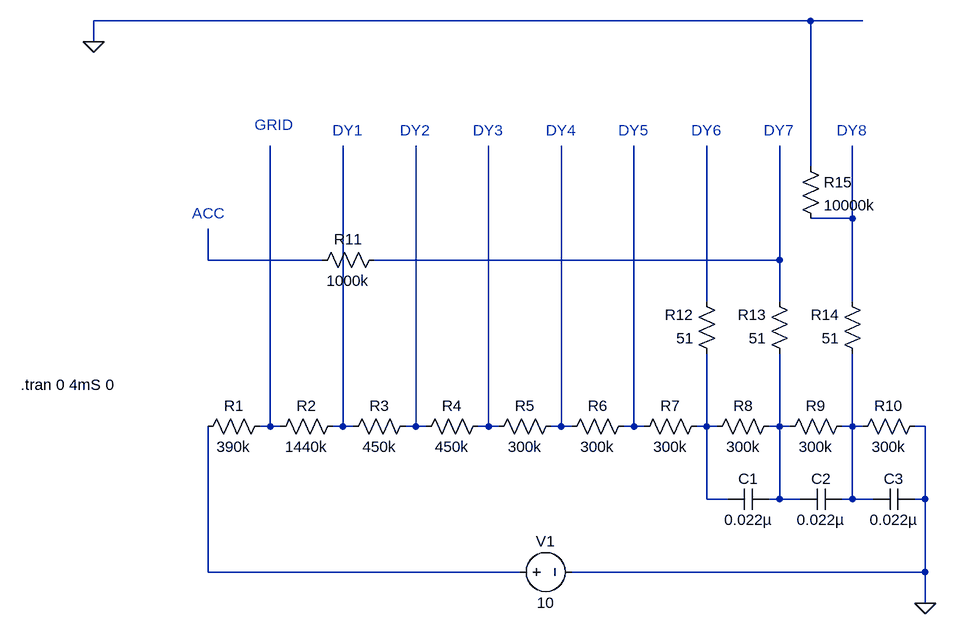
[diagram p0: schematic divider.asc]
divider.asc, the LTspice schematic file:
Version 4
SHEET 1 992 792
WIRE 800 -176 -304 -176
WIRE 880 -176 800 -176
WIRE -304 -144 -304 -176
WIRE 800 48 800 -176
WIRE 864 128 864 16
WIRE 864 128 800 128
WIRE -128 192 -128 144
WIRE 48 192 -128 192
WIRE 752 192 752 16
WIRE 752 192 128 192
WIRE 640 256 640 16
WIRE 752 256 752 192
WIRE 864 256 864 128
WIRE -32 448 -32 16
WIRE -32 448 -48 448
WIRE -16 448 -32 448
WIRE 80 448 80 16
WIRE 80 448 64 448
WIRE 96 448 80 448
WIRE 192 448 192 16
WIRE 192 448 176 448
WIRE 208 448 192 448
WIRE 304 448 304 16
WIRE 304 448 288 448
WIRE 320 448 304 448
WIRE 416 448 416 16
WIRE 416 448 400 448
WIRE 432 448 416 448
WIRE 528 448 528 16
WIRE 528 448 512 448
WIRE 544 448 528 448
WIRE 640 448 640 336
WIRE 640 448 624 448
WIRE 656 448 640 448
WIRE 752 448 752 336
WIRE 752 448 736 448
WIRE 768 448 752 448
WIRE 864 448 864 336
WIRE 864 448 848 448
WIRE 880 448 864 448
WIRE 976 448 960 448
WIRE 640 560 640 448
WIRE 672 560 640 560
WIRE 752 560 752 448
WIRE 752 560 736 560
WIRE 784 560 752 560
WIRE 864 560 864 448
WIRE 864 560 848 560
WIRE 896 560 864 560
WIRE 976 560 976 448
WIRE 976 560 960 560
WIRE -128 672 -128 448
WIRE 352 672 -128 672
WIRE 976 672 976 560
WIRE 976 672 432 672
WIRE 976 720 976 672
FLAG 976 720 0
FLAG -304 -144 0
SYMBOL res -32 432 R90
WINDOW 0 0 56 VBottom 2
WINDOW 3 32 56 VTop 2
SYMATTR InstName R1
SYMATTR Value 390k
SYMBOL res 80 432 R90
WINDOW 0 0 56 VBottom 2
WINDOW 3 32 56 VTop 2
SYMATTR InstName R2
SYMATTR Value 1440k
SYMBOL res 192 432 R90
WINDOW 0 0 56 VBottom 2
WINDOW 3 32 56 VTop 2
SYMATTR InstName R3
SYMATTR Value 450k
SYMBOL res 304 432 R90
WINDOW 0 0 56 VBottom 2
WINDOW 3 32 56 VTop 2
SYMATTR InstName R4
SYMATTR Value 450k
SYMBOL res 416 432 R90
WINDOW 0 0 56 VBottom 2
WINDOW 3 32 56 VTop 2
SYMATTR InstName R5
SYMATTR Value 300k
SYMBOL res 528 432 R90
WINDOW 0 0 56 VBottom 2
WINDOW 3 32 56 VTop 2
SYMATTR InstName R6
SYMATTR Value 300k
SYMBOL res 640 432 R90
WINDOW 0 0 56 VBottom 2
WINDOW 3 32 56 VTop 2
SYMATTR InstName R7
SYMATTR Value 300k
SYMBOL res 752 432 R90
WINDOW 0 0 56 VBottom 2
WINDOW 3 32 56 VTop 2
SYMATTR InstName R8
SYMATTR Value 300k
SYMBOL res 864 432 R90
WINDOW 0 0 56 VBottom 2
WINDOW 3 32 56 VTop 2
SYMATTR InstName R9
SYMATTR Value 300k
SYMBOL res 976 432 R90
WINDOW 0 0 56 VBottom 2
WINDOW 3 32 56 VTop 2
SYMATTR InstName R10
SYMATTR Value 300k
SYMBOL res 144 176 R90
WINDOW 0 0 56 VBottom 2
WINDOW 3 32 56 VTop 2
SYMATTR InstName R11
SYMATTR Value 1000k
SYMBOL res 656 352 R180
WINDOW 0 36 76 Left 2
WINDOW 3 36 40 Left 2
SYMATTR InstName R12
SYMATTR Value 51
SYMBOL res 768 352 R180
WINDOW 0 36 76 Left 2
WINDOW 3 36 40 Left 2
SYMATTR InstName R13
SYMATTR Value 51
SYMBOL res 880 352 R180
WINDOW 0 36 76 Left 2
WINDOW 3 36 40 Left 2
SYMATTR InstName R14
SYMATTR Value 51
SYMBOL cap 736 544 R90
WINDOW 0 0 32 VBottom 2
WINDOW 3 32 32 VTop 2
SYMATTR InstName C1
SYMATTR Value 0.022µ
SYMBOL cap 848 544 R90
WINDOW 0 0 32 VBottom 2
WINDOW 3 32 32 VTop 2
SYMATTR InstName C2
SYMATTR Value 0.022µ
SYMBOL cap 960 544 R90
WINDOW 0 0 32 VBottom 2
WINDOW 3 32 32 VTop 2
SYMATTR InstName C3
SYMATTR Value 0.022µ
SYMBOL voltage 336 672 R270
WINDOW 0 32 56 VTop 2
WINDOW 3 -32 56 VBottom 2
SYMATTR InstName V1
SYMATTR Value 10
SYMBOL res 784 32 R0
SYMATTR InstName R15
SYMATTR Value 10000k
TEXT -416 384 Left 2 !.tran 0 4mS 0
TEXT 64 -8 Left 2 ;DY1
TEXT 168 -8 Left 2 ;DY2
TEXT 280 -8 Left 2 ;DY3
TEXT 392 -8 Left 2 ;DY4
TEXT 504 -8 Left 2 ;DY5
TEXT 616 -8 Left 2 ;DY6
TEXT 728 -8 Left 2 ;DY7
TEXT 840 -8 Left 2 ;DY8
TEXT -56 -16 Left 2 ;GRID
TEXT -152 120 Left 2 ;ACC

The netlist it stands for:
* divider.asc
R1 N005 N014 390k
R2 N006 N005 1440k
R3 N007 N006 450k
R4 N008 N007 450k
R5 N009 N008 300k
R6 N010 N009 300k
R7 N011 N010 300k
R8 N012 N011 300k
R9 N013 N012 300k
R10 0 N013 300k
R11 N003 N002 1000k
R12 N011 N004 51
R13 N012 N003 51
R14 N013 N001 51
C1 N012 N011 0.022µ
C2 N013 N012 0.022µ
C3 0 N013 0.022µ
V1 N014 0 10
R15 0 N001 10000k
.tran 0 4mS 0
* DY1
* DY2
* DY3
* DY4
* DY5
* DY6
* DY7
* DY8
* GRID
* ACC
.backanno
.end